# Altium project PTW_ECU_Original.PrjPcb
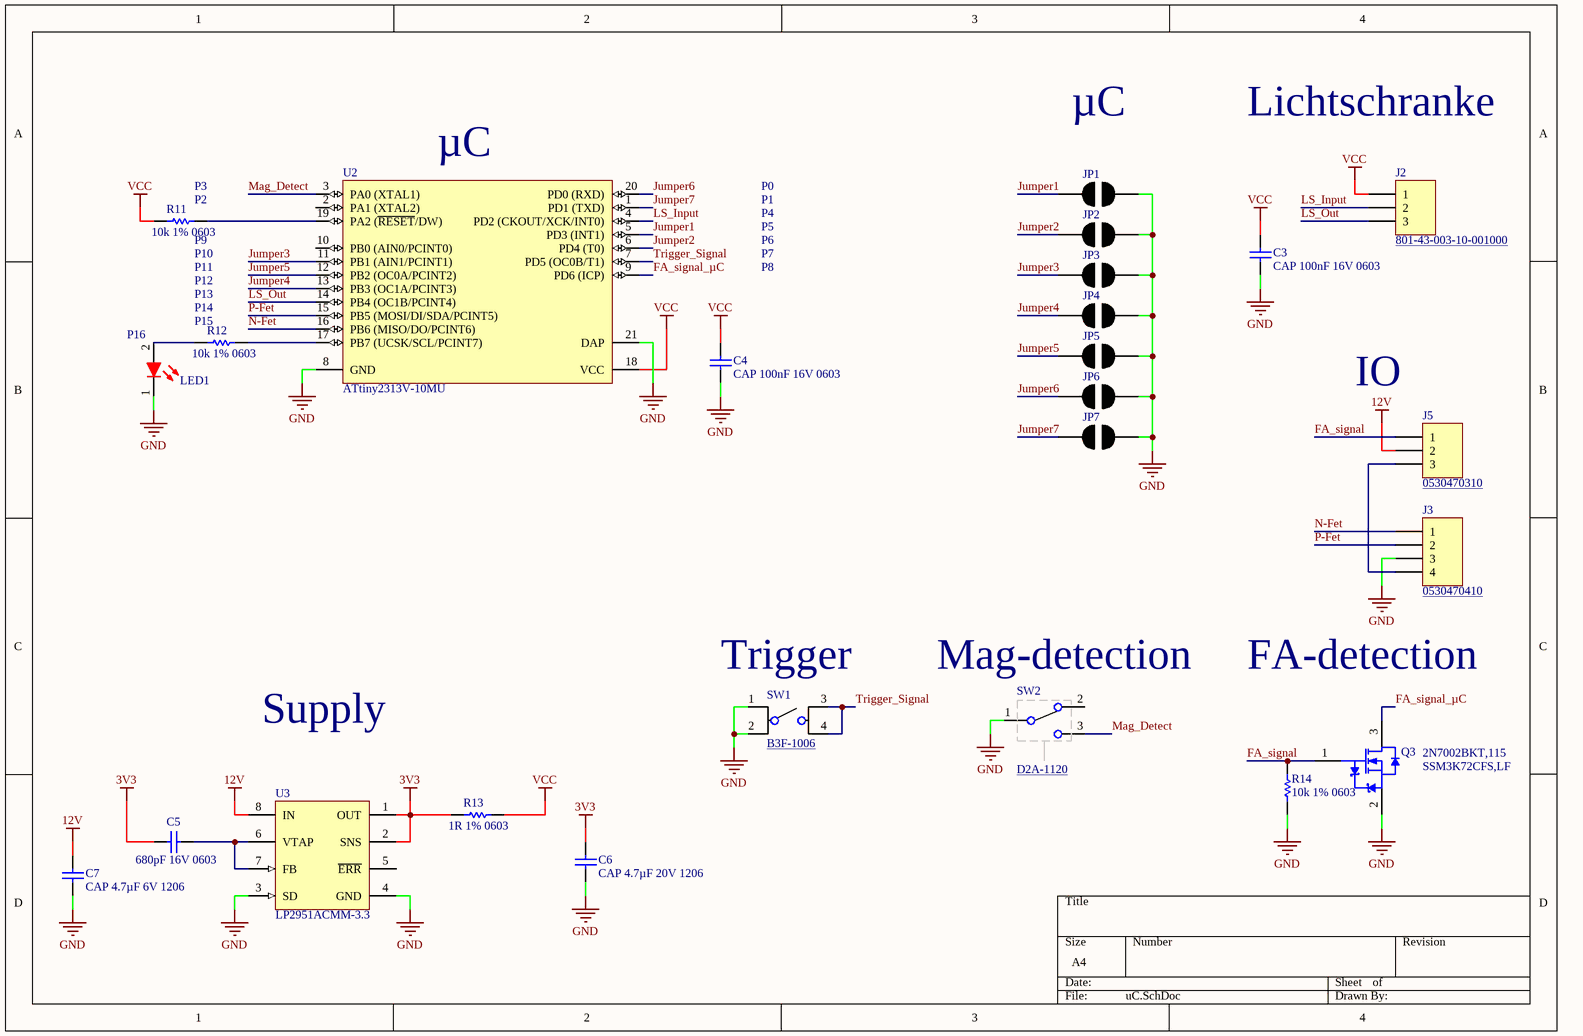
[diagram p0: uC.SchDoc]
1 sheet, 25 parts. Net scope: global (net labels, ports and power ports of the same name join across sheets).
Board file: PTW_ECU_Original.PcbDoc

## Sheet uC.SchDoc
size A4

### Parts
C3  CAP 100nF 16V 0603  [CAPC0603(1608)100_N]
C4  CAP 100nF 16V 0603  [CAPC0603(1608)100_N]
C5  680pF 16V 0603  [CAPC0603(1608)100_L]
C6  CAP 4.7µF 20V 1206  [CAPC1206(3216)190_M]
C7  CAP 4.7µF 6V 1206  [CAPC1206(3216)190_M]
J2  801-43-003-10-001000  [801-43-003-10-001000]
J3  0530470410  [530470410]
J5  0530470310  [530470310]
JP1  Jumperpads  [Jumper]  (value not drawn)
JP2  Jumperpads  [Jumper]  (value not drawn)
JP3  Jumperpads  [Jumper]  (value not drawn)
JP4  Jumperpads  [Jumper]  (value not drawn)
JP5  Jumperpads  [Jumper]  (value not drawn)
JP6  Jumperpads  [Jumper]  (value not drawn)
JP7  Jumperpads  [Jumper]  (value not drawn)
LED1  (no value)  [WE-LED-0603_RD_N]
Q3  2N7002BKT,115  [NXP-SOT416_B_N]
R11  10k 1% 0603  [RESC0603(1608)_M]
R12  10k 1% 0603  [RESC0603(1608)_M]
R13  1R 1% 0603  [RESC0603(1608)_M]
R14  10k 1% 0603  [RESC0603(1608)_M]
SW1  B3F-1006  [OMRON B3F-1006]
SW2  D2A-1120  [D2A-1120]
U2  ATtiny2313V-10MU  [20M1_M]
U3  LP2951ACMM-3.3  [DGK0008A_N]

### Nets
3V3: C5.1 C6.2 R13.1 U3.1(OUT) U3.2(SNS)
12V: C7.1 J5.2 U3.8(IN)
GND: C3.1 C4.1 C6.1 C7.2 J3.3 JP1.2 JP2.2 JP3.2 JP4.2 JP5.2 JP6.2 JP7.2 LED1.1(K) Q3.2(S) R14.1 SW1.1(IN) SW1.2(IN) SW2.1(COM) U2.8(GND) U2.21(DAP) U3.3(SD) U3.4(GND)
VCC: C3.2 C4.2 J2.1 R11.1 R13.2 U2.18(VCC)
FA_signal: J5.1 Q3.1(G) R14.2
FA_signal_µC: Q3.3(D) U2.9(PD6_(ICP))
Jumper1: JP1.1 U2.5(PD3_(INT1))
Jumper2: JP2.1 U2.6(PD4_(T0))
Jumper3: JP3.1 U2.11(PB1_(AIN1/PCINT1))
Jumper4: JP4.1 U2.13(PB3_(OC1A/PCINT3))
Jumper5: JP5.1 U2.12(PB2_(OC0A/PCINT2))
Jumper6: JP6.1 U2.20(PD0_(RXD))
Jumper7: JP7.1 U2.1(PD1_(TXD))
LS_Input: J2.2 U2.4(PD2_(CKOUT/XCK/INT0))
LS_Out: J2.3 U2.14(PB4_(OC1B/PCINT4))
Mag_Detect: SW2.3(NO) U2.3(PA0_(XTAL1))
N-Fet: J3.1 U2.16(PB6_(MISO/DO/PCINT6))
P-Fet: J3.2 U2.15(PB5_(MOSI/DI/SDA/PCINT5))
Trigger_Signal: SW1.3(OUT) SW1.4(OUT) U2.7(PD5_(OC0B/T1))
NetC5_2: C5.2 U3.6(VTAP) U3.7(FB)
NetJ3_4: J3.4 J5.3
NetLED1_2: LED1.2(A) R12.1
NetR11_2: R11.2 U2.19(PA2_(~{RESET}/DW))
NetR12_2: R12.2 U2.17(PB7_(UCSK/SCL/PCINT7))

Not connected (* = marked no-connect by the designer): SW2 2(NC) SH; U2 2(PA1_(XTAL2)) 10(PB0_(AIN0/PCINT0)); U3 5(~{ERR})

### Notes on the sheet
- (near U2) µC
- µC
- Lichtschranke
- (near R11) P3
- (near R11) P9
- (near R11) P2
- P0
- P1
- P4
- P5
- P6
- (near R11) P10
- (near R11) P11
- P12
- (near R12) P13
- (near R12) P14
- P7
- P8
- (near LED1) P16
- (near R12) P15
- (near J5) IO
- (near SW1) Trigger
- (near SW2) Mag-detection
- FA-detection
- Supply
- (near Q3) SSM3K72CFS,LF

### Library data of the parts
C3 C4 = CMP-1035-02585-1: CAP 100nF 16V ±20% 0603 (1608 Metric) Thickness 1mm SMD; Case-EIA: 0603; Tolerance: Â±20%; Case-Metric: 1608; Technology: SMT; Rated Voltage: 16 V; Value: 100nF; Max Thickness: 1 mm
C5 = CMP-1035-01407-1: CAP 180pF 16V ±2% 0603 (1608 Metric) Thickness 1mm SMD; Case-EIA: 0603; Case-Metric: 1608; Tolerance: Â±2%; Rated Voltage: 16 V; Technology: SMT; Max Thickness: 1 mm; Value: 180pF
C6 C7 = CMP-1037-04189-1: CAP 100nF 25V ±5% 1206 (3216 Metric) Thickness 1.9mm SMD; Case-Metric: 3216; Case-EIA: 1206; Tolerance: Â±5%; Rated Voltage: 25 V; Technology: SMT; Max Thickness: 1.9 mm; Value: 100nF
J2 = 801-43-003-10-001000: 3 Pim header socket 7mm height; ComponentLink1Description: Datasheet; ComponentLink1URL: https://www.mill-max.com/products/socket/801-xx-xxx-10-001000/801-43-003-10-001000?s_term=801-43-003-10-001000&s_type=Quick%2FProduct%2FPart+Number+Search
J3 = 0530470410: Molex Picoblade, 4Pin THT Straight; ComponentLink1Description: Datasheet; ComponentLink1URL: http://www.molex.com/pdm_docs/sd/530470410_sd.pdf
J5 = 0530470310: Molex Picoblade, 3Pin THT Straight; ComponentLink1Description: Datasheet; ComponentLink1URL: http://www.molex.com/pdm_docs/sd/530470310_sd.pdf; Supplier 1: Mouser; Supplier 2: Digi-Key; Supplier Part Number 1: 538-53047-0310; Supplier Part Number 2: WM1732-ND
LED1 = LED_0603_RD: Chip LED 0603 red; Dicke: 0.35mm; Abstrahlwinkel: 180°; Color: red; Spannung - Nenn: ?; Current: ?; Brightness: ?; Package / Case: 0603 (1608 metric); Manufacturer: *; Manufacturer Part Number: *
Q3 = CMP-1259-00271-1: N-Channel Trench MOSFET, 60 V, 0.29 A, -55 to 150 degC, 3-Pin SOT416, Tape and Reel; Manufacturer: NXP Semiconductors; Automotive Qualified: Y; Packing: Tape & Reel; IDM [max] (A): 1.2; ID [max] (A): 0.29; VGSth [typ] (V): 1.6; Channel Type: N; VDS [max] (V): 60; Code_JEITA: SC-75; DatasheetVersion: Rev. 1; PackageVersion: 06-03-16, 03/2006; ComponentLink3Description: Package Specification; ComponentLink1URL: http://www.nxp.com/; PartNumber: 2N7002BKT,115; ComponentLink2URL: http://www.nxp.com/documents/data_sheet/2N7002BKT.pdf; Mounting Technology: Surface Mount; ComponentLink1Description: Manufacturer URL; PackageDescription: 3-Pin Small Outline Transistor Package, Body 1.6 x 0.8 mm, Pitch 0.5 mm; PackageReference: SOT416_B; ComponentLink3URL: http://www.nxp.com/documents/data_sheet/2N7002PT.pdf; ComponentLink2Description: Datasheet
R11-R14 = CMP-1012-00220-1: 2R8 0.1W 1% 0603 (1608 Metric)  SMD; Value: 2.80 Ohm; Case-EIA: 0603; Case-Metric: 1608; Power: 0.1 W; Technology: SMT; Tolerance: 1 %
SW1 = B3F-1006: Tactile Switch Omron B3F-1006; Contact Resistance: 50mOhm; Travel: 0.25mm; ComponentLink1Description: Datasheet; ComponentLink1URL: https://omronfs.omron.com/en_US/ecb/products/pdf/en-b3f.pdf; Manufacture specification: B3F-1006
SW2 = D2A-1120: SWITCH TACTILE Omron D2A 0.1A 30V; Manufacturer Part: MK-12C02-PB; Switch Function: On-On; Current Rating: 0.1A @ 30VDC; Actuator Type: Standard; Contact resistence: 50mΩ max.; Insulation: 100MΩ min.; Operating force: 50gf±1gf; ComponentLink1Description: Manufacturer URL; ComponentLink1URL: http://components.omron.eu/; Manufacturer: Omron; Mounting Type: Through Hole; ComponentLink2Description: Datasheet; ComponentLink2URL: https://omronfs.omron.com/en_US/ecb/products/pdf/en-d2a.pdf; Operating Temperature: -10°C ~ 80°C
U2 = CMP-0093-00093-2: Low Power tinyAVR® 8-Bit Microcontroller, 1.8-5.5V, 10MHz, 2K Flash Memory, Industrial Grade (-40°C to 85°C), 20-Lead MLF, Pb-Free; PackageReference: 20M1; ComponentLink3URL: http://www.atmel.com/dyn/resources/prod_documents/doc2543S.pdf; DatasheetVersion: revL, Aug-2010; PackageVersion: revA, Oct-2004; ComponentLink2URL: http://www.atmel.com/dyn/resources/prod_documents/doc2543.pdf; RevisionNote: DatasheetVersion updated. DAP pin added. URLs added.; Code_JEDEC: MO-220WGGD-5; ComponentLink1Description: Manufacturer URL; PackageDescription: 20-pad, 4 x 4 x 0.8 mm Body, Lead Pitch 0.50 mm, 2.6 mm Exposed Pad, Micro Lead Frame Package (MLF); ComponentLink1URL: http://www.atmel.com/; ComponentLink2Description: ATtiny2313 Datasheet; ComponentLink3Description: ATtiny2313 Summary
U3 = CMP-0062-02229-3: Series of Adjustable Micropower Voltage Regulators, 8-pin Mini SOIC; Manufacturer: Texas Instruments; PackageTopMarking: ZXTT*L0CA; CompType: LDO IC; PowerWise: N; ComponentLink1URL: http://www.ti.com/general/docs/lit/getliterature.tsp?genericPartNumber=LP2951-N&fileType=pdf; ComponentLink1Description: Datasheet URL; Code_JEDEC: MO-187-AA; RoHS: N; PackageDescription: MINI SOIC, .118 x .118 x .034in, 8 Lead, .0256in Pitch; PinCount: 8; PackageReference: DGK0008A